# EAGLE design ScoutMakes_FM_Kit (EAGLE 9.6.1)
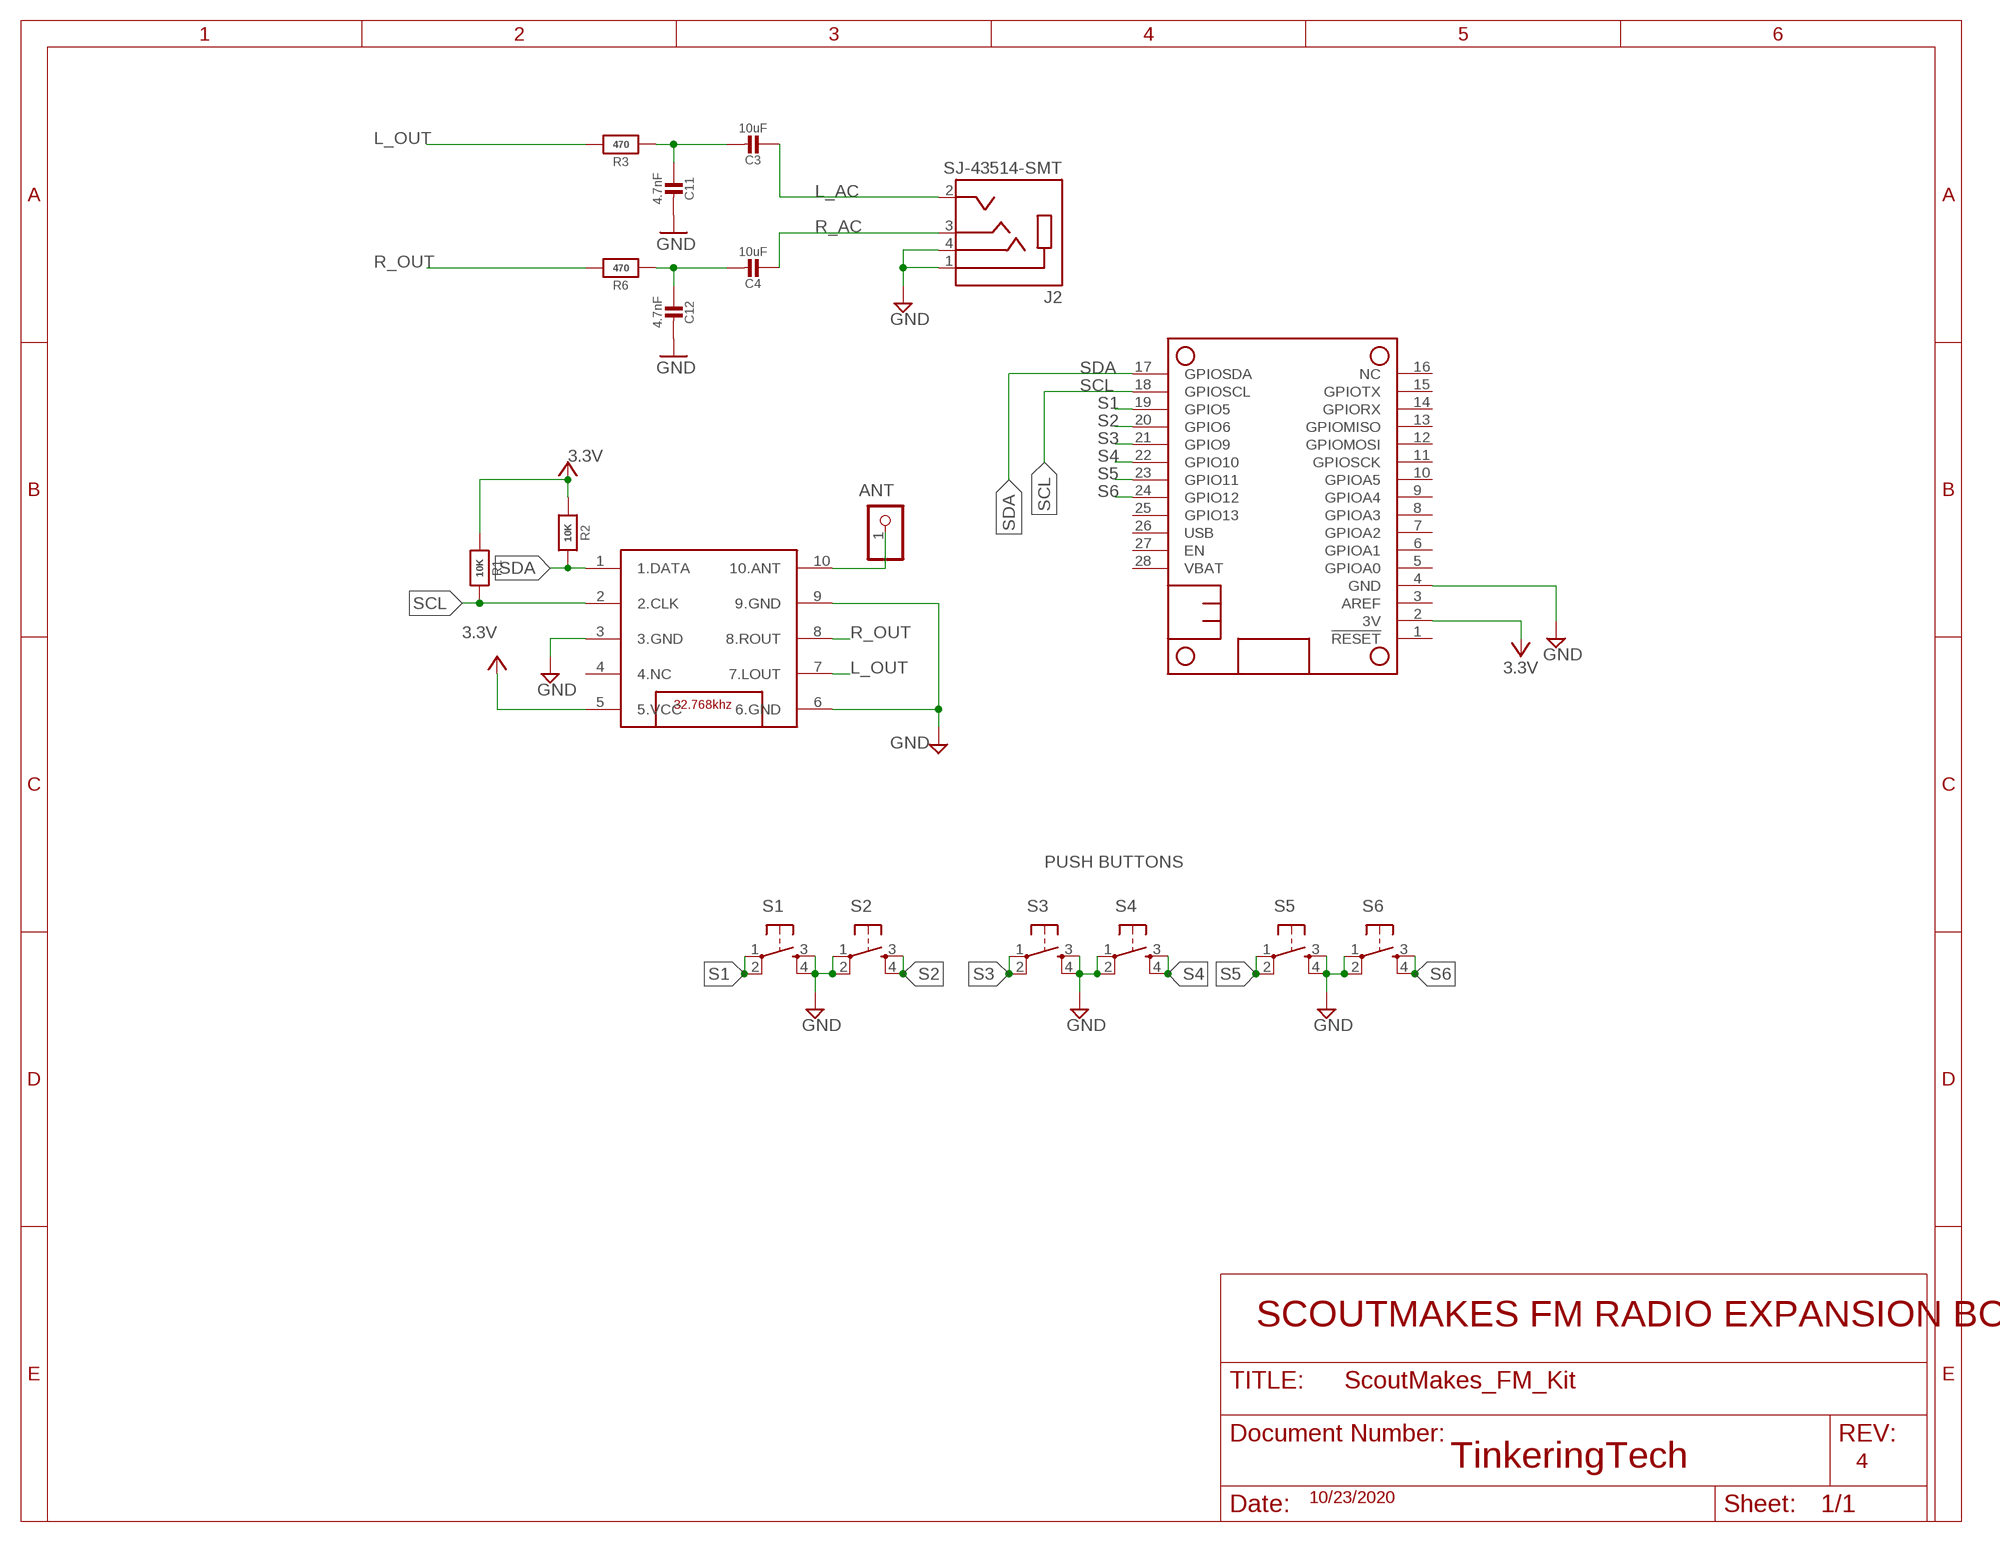
[diagram p0: schematic, sheet 1]

## Parts
ANT  PINHD-1X1  [1X01]
C3  10uF  CAP_CERAMIC0805-NOOUTLINE  [0805-NO]
C4  10uF  CAP_CERAMIC0805-NOOUTLINE  [0805-NO]
C11  4.7nF  CAP_CERAMIC0805-NOOUTLINE  [0805-NO]
C12  4.7nF  CAP_CERAMIC0805-NOOUTLINE  [0805-NO]
J2  SJ-43514-SMT  [CUI_SJ-43514-SMT]
MS2  FEATHERWING_NODIM  [FEATHERWING_DIM]
R1  10K  RESISTOR_0603_NOOUT  [0603-NO]
R2  10K  RESISTOR_0603_NOOUT  [0603-NO]
R3  470  RESISTOR0805_NOOUTLINE  [0805-NO]
R6  470  RESISTOR0805_NOOUTLINE  [0805-NO]
S1  DTS-6  [DTS-6]
S2  DTS-6  [DTS-6]
S3  DTS-6  [DTS-6]
S4  DTS-6  [DTS-6]
S5  DTS-6  [DTS-6]
S6  DTS-6  [DTS-6]
U1  TEA5767  [TJ-102BC]

## Nets
3.3V: MS2.2(3V) R1.1 R2.1 U1.5(5.VCC)
ANT: ANT.1 U1.10(10.ANT)
GND: C11.2 C12.2 J2.1(SLEEVE) J2.4(RING2) MS2.4(GND) S1.3 S1.4 S2.1 S2.2 S3.3 S3.4 S4.1 S4.2 S5.3 S5.4 S6.1 S6.2 U1.3(3.GND) U1.6(6.GND) U1.9(9.GND)
L_AC: C3.1 J2.2(TIP)
L_OUT: R3.1 U1.7(7.LOUT)
N$5: C4.2 C12.1 R6.2
N$6: C3.2 C11.1 R3.2
R_AC: C4.1 J2.3(RING1)
R_OUT: R6.1 U1.8(8.ROUT)
S1: MS2.19(GPIO5) S1.1 S1.2
S2: MS2.20(GPIO6) S2.3 S2.4
S3: MS2.21(GPIO9) S3.1 S3.2
S4: MS2.22(GPIO10) S4.3 S4.4
S5: MS2.23(GPIO11) S5.1 S5.2
S6: MS2.24(GPIO12) S6.3 S6.4
SCL: MS2.18(GPIOSCL) R1.2 U1.2(2.CLK)
SDA: MS2.17(GPIOSDA) R2.2 U1.1(1.DATA)
Unconnected: MS2.1(!RESET) MS2.3(AREF) MS2.5(GPIOA0) MS2.6(GPIOA1) MS2.7(GPIOA2) MS2.8(GPIOA3) MS2.9(GPIOA4) MS2.10(GPIOA5) MS2.11(GPIOSCK) MS2.12(GPIOMOSI) MS2.13(GPIOMISO) MS2.14(GPIORX) MS2.15(GPIOTX) MS2.16(NC) MS2.25(GPIO13) MS2.26(USB) MS2.27(EN) MS2.28(VBAT) U1.4(4.NC)

## Notes on the sheet
- PUSH BUTTONS
- SCOUTMAKES FM RADIO EXPANSION BOARD
- TinkeringTech | 4
- 10/23/2020

## Library data of the parts
ANT = adafruit:PINHD-1X1: Pin header 1x1 for 0.1" spacing With round pins
C3 C4 C11 C12 = microbuilder:CAP_CERAMIC: Ceramic Capacitors For new designs, use the packages preceded by an '_' character since they are more reliable: The following footprints should be used on most boards: _0402 - Standard footprint for regular board layouts _0603 - Standard footprint for regular board layouts _0805 - Standard footprint for regular board layouts _1206 - Standard footprint for regular board layouts For extremely tight-pitch boards where space is at a premium, the following 'micro-pitch' footprints can be used (smaller pads, no silkscreen outline, etc.): _0402MP - Micro-pitch footprint for very dense/compact boards _0603MP - Micro-pitch footprint for very dense/compact boards _0805MP - Micro-pitch footprint for very dense/compact boards _1206MP - Micro-pitch footprint for very dense/compact boards
J2 = SJ-43514-SMT:SJ-43514-SMT: 4 conductor 3.5 mm Surface Mount Audio Jack; CUI_PURCHASE_URL: https://www.cuidevices.com/product/interconnect/connectors/audio-connectors/jacks/sj-4351x-smt-series?utm_source=snapeda.com&utm_medium=referral&utm_campaign=snapedaBOM; DESCRIPTION: 3.5 mm, 4 Conductors, Right Angle, Surface Mount (SMT), Audio Jack Connector; DIGI-KEY_PART_NUMBER: CP-43514SJCT-ND; MF: CUI Devices; MP: SJ-43514-SMT-TR; PACKAGE: None; PURCHASE-URL: https://pricing.snapeda.com/search/part/SJ-43514-SMT-TR/?ref=eda
MS2 = adafruit:FEATHERWING
R1-R3 R6 = microbuilder:RESISTOR: Resistors For new designs, use the packages preceded by an '_' character since they are more reliable: The following footprints should be used on most boards: _0402 - Standard footprint for regular board layouts _0603 - Standard footprint for regular board layouts _0805 - Standard footprint for regular board layouts _1206 - Standard footprint for regular board layouts For extremely tight-pitch boards where space is at a premium, the following 'micro-pitch' footprints can be used (smaller pads, no silkscreen outline, etc.): _0402MP - Micro-pitch footprint for very dense/compact boards _0603MP - Micro-pitch footprint for very dense/compact boards _0805MP - Micro-pitch footprint for very dense/compact boards _1206MP - Micro-pitch footprint for very dense/compact boards
S1-S6 = switch-tact:DTS-6
U1 = TEA5767:TEA5767

## Board
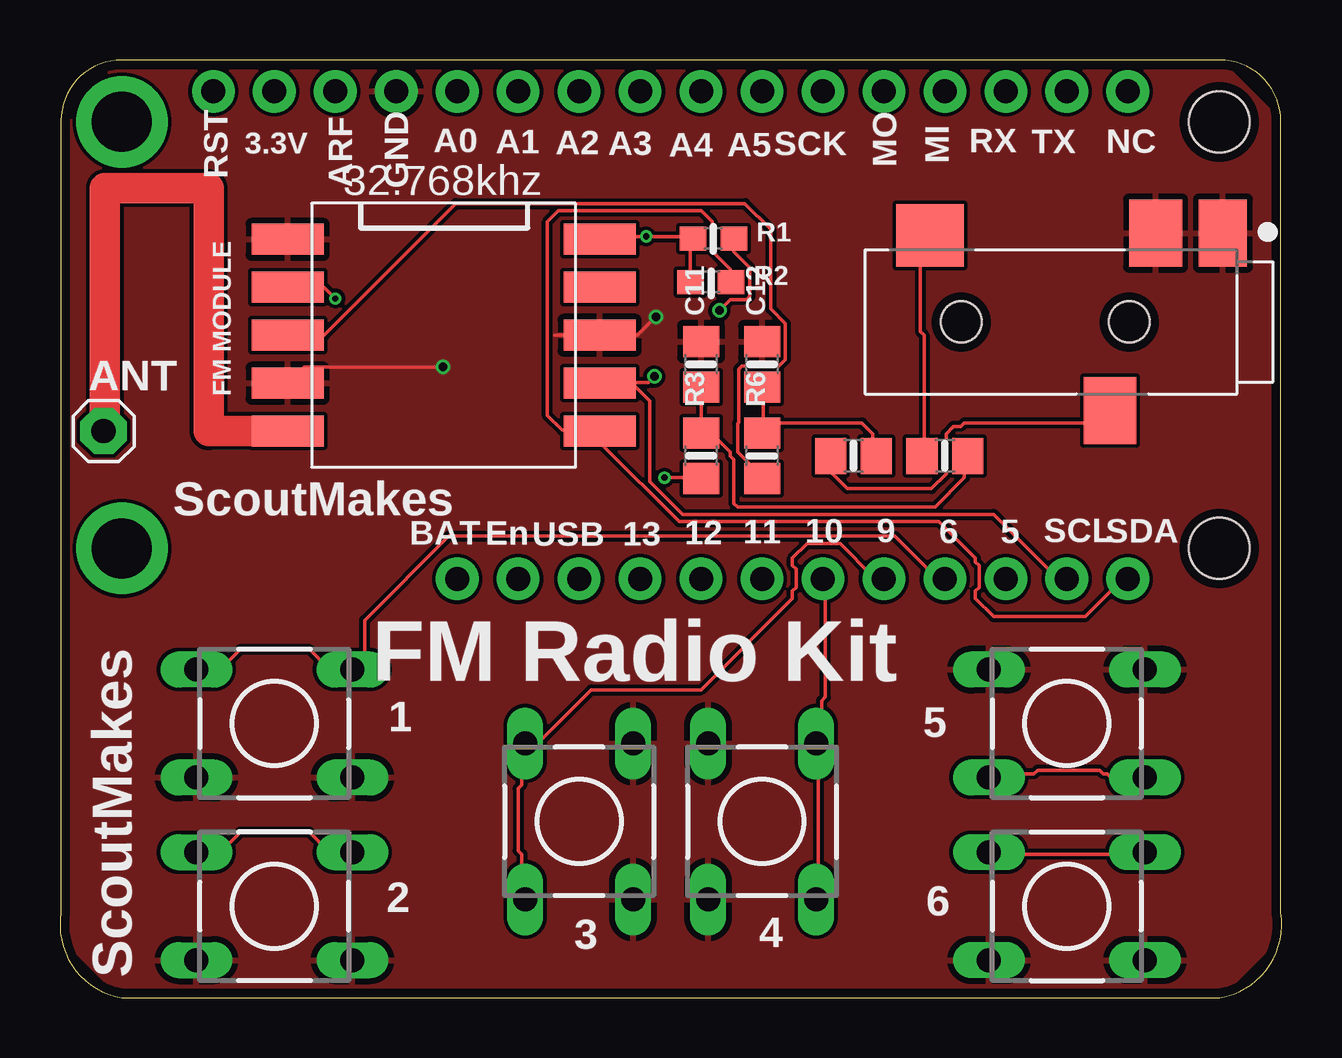
[diagram p1: board, top side]
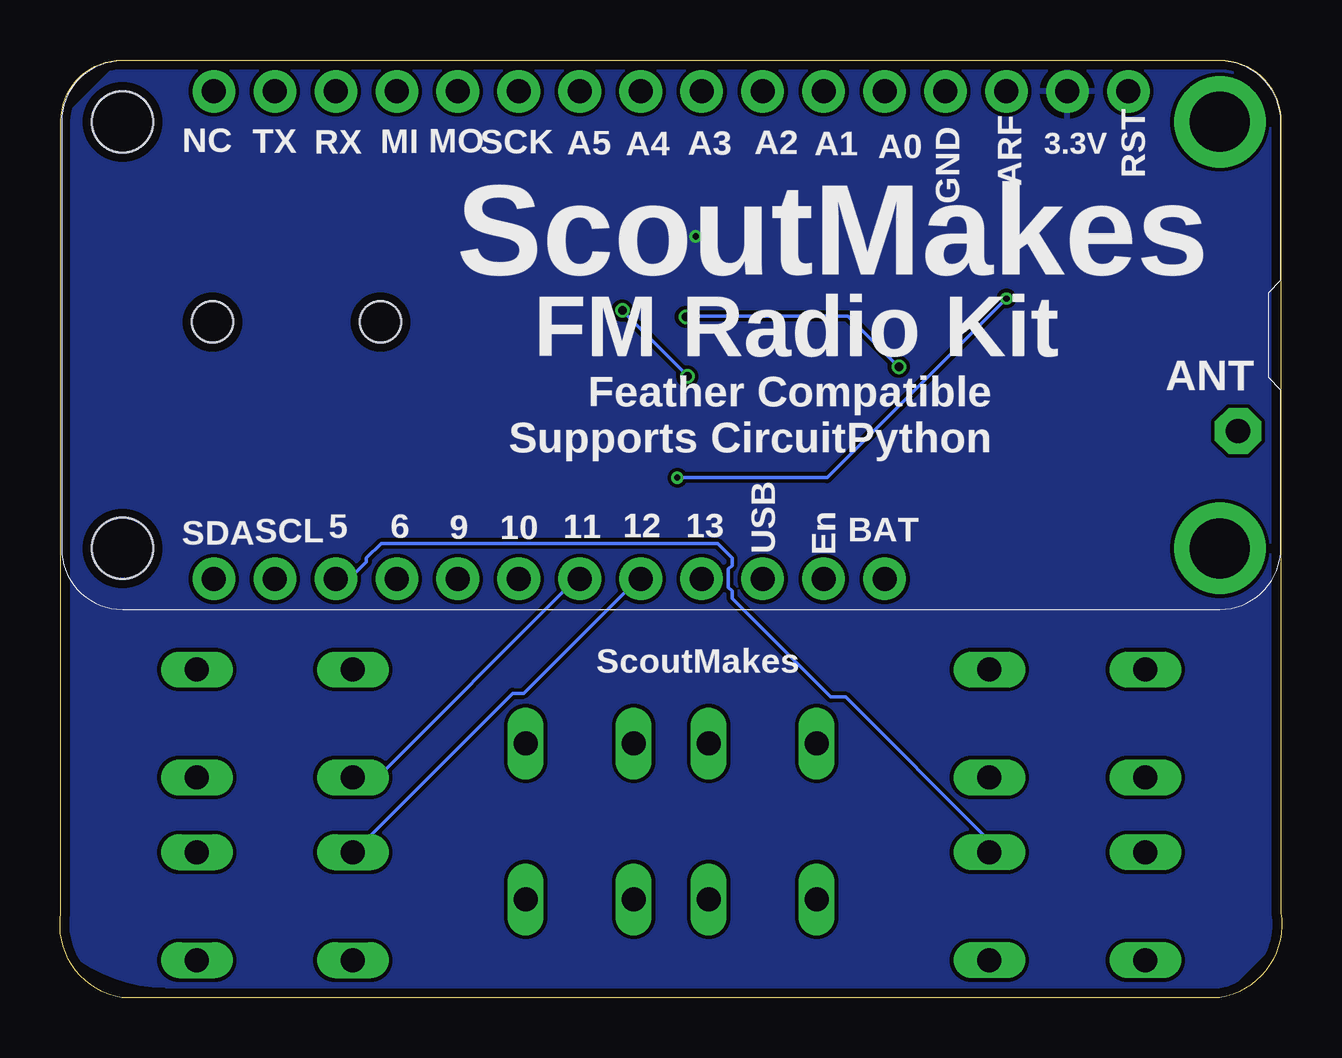
[diagram p2: board, bottom side, seen from below]

Size 50.91 x 39.09 mm. Coordinates in mm from the lower left corner, seen from the top.
Outline: 0.04,36.55 0.04,3.54 arc90 2.58,0 48.33,0 arc90 50.87,3.54 50.87,36.55 arc90 48.33,39.09 2.58,39.09 arc90 0.04,36.55
Copper layers (1*16): Top 0.035559375mm / dielectric 1.6mm / Bottom 0.035559375mm
Design rules "oshpark-2layer *": minimum track width 6mil, minimum drill 10mil, track to track 6mil, track to pad 6mil, pad to pad 6mil, via to via 6mil, smd to smd 6mil, copper to edge 15mil, drill to drill 6mil, minimum pad ring 5mil, minimum via ring 5mil, stop-mask expansion 2.5mil, vias tented up to drill 20mil, thermal gap 10mil

### Footprints (pad centres in the part's own frame; a part is rotated, then mirrored left to right if it is on the bottom)
1X01 = drill 1.016 pad 1.93 octagon: 1 0,0
0805-NO = smd 1.3 x 1.5: 1 -0.95,0; 2 0.95,0
CUI_SJ-43514-SMT = smd 2 x 2.8: 1 -7.15,-3.7 | smd 2.8 x 2.6: 2 5.05,-3.6 | smd 2.2 x 2.8: 3 -2.45,3.7; 4 -4.35,-3.7 | hole 1.7: -3.25,0; 3.75,0
FEATHERWING_DIM = drill 1 pad 1.778: 1 6.35,1.27; 2 8.89,1.27; 3 11.43,1.27; 4 13.97,1.27; 5 16.51,1.27; 6 19.05,1.27; 7 21.59,1.27; 8 24.13,1.27; 9 26.67,1.27; 10 29.21,1.27; 11 31.75,1.27; 12 34.29,1.27; 13 36.83,1.27; 14 39.37,1.27; 15 41.91,1.27; 16 44.45,1.27; 17 44.45,21.59; 18 41.91,21.59; 19 39.37,21.59; 20 36.83,21.59; 21 34.29,21.59; 22 31.75,21.59; 23 29.21,21.59; 24 26.67,21.59; 25 24.13,21.59; 26 21.59,21.59; 27 19.05,21.59; 28 16.51,21.59 | drill 2.5 pad 3.81: P$1 2.54,20.32; P$2 2.54,2.54 | hole 2.54: 48.26,20.32; 48.26,2.54
0603-NO = smd 1.1 x 1: 1 -0.85,0; 2 0.85,0
DTS-6 = drill 1 long: 1 -3.25,2.25; 2 3.25,2.25; 3 -3.25,-2.25; 4 3.25,-2.25
TJ-102BC = smd 3 x 1.3: 1 -2,0.5; 2 -2,-1.5; 3 -2,-3.5; 4 -2,-5.5; 5 -2,-7.5; 6 11,-7.5; 7 11,-5.5; 8 11,-3.5; 9 11,-1.5; 10 11,0.5

### Placement (x,y rotation side)
ANT  1.82,23.62 0 top
C3  36.87,22.59 0 top
C4  33.06,22.59 0 top
C11  26.71,26.4 90 top
C12  29.25,26.4 90 top
J2  41.3,28.17 180 top
MS2  0.04,39.05 180 bottom
R1  27.23,31.65 0 top
R2  27.11,29.84 0 top
R3  26.71,22.59 90 top
R6  29.25,22.59 90 top
S1  8.93,3.81 0 top
S2  8.93,11.43 180 top
S3  21.63,7.35 90 top
S4  29.25,7.35 90 top
S5  41.95,11.43 180 top
S6  41.95,3.81 180 top
U1  20.49,24.12 180 top

### Tracks (layer width: path | path; a pad name or v marks a point on that pad's centre or on a via)
3.3V  (via drill 0.25)
  Top 0.152: R2.1 26.25,29.91 26.25,31.58 R1.1 26.25,31.73 v24.42,31.73 22.6,31.73 U1.5
  pour Bottom: 0.04,36.56 2.21,38.73 arc-45 3.11,39.1 48.3,39.1 50.47,36.93 arc-45 50.84,36.03 50.84,2.27 arc-45 46.5,0.47 46.03,0 2.58,0 0.04,2.54
ANT
  Top 0.152: 1.87,23.66 ANT.1
  Top 1.27: U1.10 6.19,23.62 6.19,33.75 1.87,33.75 1.87,23.66
GND  (via drill 0.35)
  Top 0.152: 20.61,27.62 22.44,27.62 U1.3 24.06,27.62 v24.83,28.38 | U1.9 10.17,26.3 v15.96,26.3
  Bottom 0.152: v15.96,26.3 18.07,28.42 24.8,28.42 v24.83,28.38
  pour Top: 2.58,39.1 48.3,39.1 50.84,36.56 50.84,2.54 48.3,0 2.58,0 0.04,2.54 0.04,36.56
L_AC
  Top 0.152: C3.1 36.01,22.59 36.01,27.62 35.85,27.77 35.85,31.43 36.16,31.73 J2.2
L_OUT  (via drill 0.25)
  Top 0.152: v25.19,21.68 26.71,21.68 R3.1 | v11.47,29.14 11.01,29.6 9.49,29.6 U1.7
  Bottom 0.152: v25.19,21.68 18.94,21.68 v11.47,29.14
N$5
  Top 0.152: 29.3,23.96 29.3,25.33 C12.1 | 29.3,23.96 29.3,23.66 R6.2 29.3,23.96 | 29.3,23.96 33.42,23.96 33.87,23.5 33.87,22.59 C4.2
N$6
  Top 0.152: C11.1 R3.2 26.71,23.5 27.17,23.5 27.93,22.74 27.93,22.59 28.08,22.44 28.08,20.61 28.23,20.46 36.46,20.46 37.68,21.68 37.68,22.59 C3.2
R_AC
  Top 0.152: C4.1 32.2,22.59 32.2,21.83 32.81,21.22 36.31,21.22 36.92,21.83 36.92,23.5 37.23,23.81 37.53,23.81 37.68,23.96 43.17,23.96 43.63,24.42 J2.3
R_OUT
  Top 0.152: R6.1 29.15,21.68 28.69,22.13 28.69,22.29 28.23,22.74 28.23,23.93 28.27,23.97 28.27,26.2 28.41,26.33 29.95,26.33 30.23,26.61 30.23,28.09 29.61,28.72 29.61,32.04 28.54,33.11 16.5,33.11 11.01,27.62 U1.8
S1
  Top 0.152: S1.1 5.83,6.13 6.75,6.13 7.51,6.89 10.4,6.89 11.17,6.13 12.08,6.13 S1.2
  Bottom 0.152: MS2.19 39.36,17.56 38.75,17.56 38.14,18.17 38.14,18.32 37.53,18.93 23.51,18.93 22.9,18.32 22.9,18.02 23.05,17.87 23.05,17.1 22.9,16.95 22.9,16.65 18.79,12.53 18.18,12.53 12.23,6.59 12.23,6.13 S1.2
S2
  Top 0.152: S2.4 5.83,13.75 6.75,13.75 7.51,14.51 10.4,14.51 11.17,13.75 12.08,13.75 S2.3 12.23,13.75 12.69,14.21 12.69,15.73 16.19,19.24 34.79,19.24 36.46,17.56 36.77,17.56 MS2.20
S3
  Top 0.152: S3.1 19.24,4.15 19.24,5.98 19.09,6.13 19.09,8.72 19.24,8.87 19.24,10.55 S3.2 19.4,10.7 20,10.7 22.14,12.84 26.71,12.84 30.52,16.65 30.52,16.95 30.67,17.1 30.67,17.87 30.52,18.02 30.52,18.32 31.13,18.93 32.5,18.93 33.87,17.56 34.33,17.56 MS2.21
S4
  Top 0.152: S4.3 31.59,4.15 31.59,10.55 S4.4 31.59,10.7 31.74,10.86 31.74,12.38 31.89,12.53 31.89,17.41 MS2.22
S5
  Top 0.152: S5.2 38.75,9.33 40.58,9.33 40.73,9.48 43.32,9.48 43.47,9.33 43.63,9.33 43.78,9.18 45.15,9.18 S5.1
  Bottom 0.152: MS2.23 29.76,16.95 29.91,16.95 37.53,9.33 38.6,9.33 S5.2
S6
  Top 0.152: S6.4 38.75,5.98 45.15,5.98 S6.3
  Bottom 0.152: MS2.24 26.71,17.41 27.17,16.95 27.32,16.95 31.59,12.68 32.04,12.68 38.6,6.13 S6.4
SCL  (via drill 0.35)
  Top 0.152: 23.66,25.64 22.6,25.64 U1.2 23.66,25.64 | 23.66,25.64 23.81,25.49 23.97,25.49 24.58,24.88 24.58,21.52 25.95,20.15 38.9,20.15 41.49,17.56 41.95,17.56 MS2.18 | v27.47,28.65 27.94,29.11 28.61,29.11 28.74,29.24 28.74,30.43 28.08,31.1 R1.2 | v24.77,25.9 24.51,25.64 23.66,25.64
  Bottom 0.152: v27.47,28.65 24.77,25.94 v24.77,25.9
SDA
  Top 0.152: R2.2 27.93,29.91 27.93,30.36 27.17,31.12 27.17,32.34 26.71,32.8 20.77,32.8 20.31,32.34 20.31,24.27 20.92,23.66 22.44,23.66 U1.1 22.6,23.5 22.6,23.05 25.8,19.85 36.62,19.85 38.14,18.32 38.14,18.17 38.29,18.02 38.29,17.1 38.14,16.95 38.14,16.65 38.9,15.88 42.71,15.88 43.78,16.95 43.93,16.95 44.39,17.41 MS2.17

### Text on the board
_tplace: RX | 3.3V | A3 | A4 | A5 | SCK | TX | NC | A0 | A1 | A2 | MO | MI | RST | ARF | GND | FM MODULE | ScoutMakes | BAT | En | USB | 13 | 12 | 11 | 10 | 9 | 6 | 5 | SCL | SDA | FM Radio Kit | ScoutMakes | 1 | 5 | 2 | 6 | 3 | 4
_bplace: GND | MO | NC | 3.3V | A3 | A4 | A5 | SCK | MI | RX | TX | A0 | A1 | A2 | RST | ARF | ScoutMakes | ANT | FM Radio Kit | Feather Compatible / Supports CircuitPython | USB | En | BAT | 13 | 12 | 11 | 10 | 9 | 6 | 5 | SCL | SDA | ScoutMakes